# EAGLE design lpc810_console (EAGLE 7.1.0)
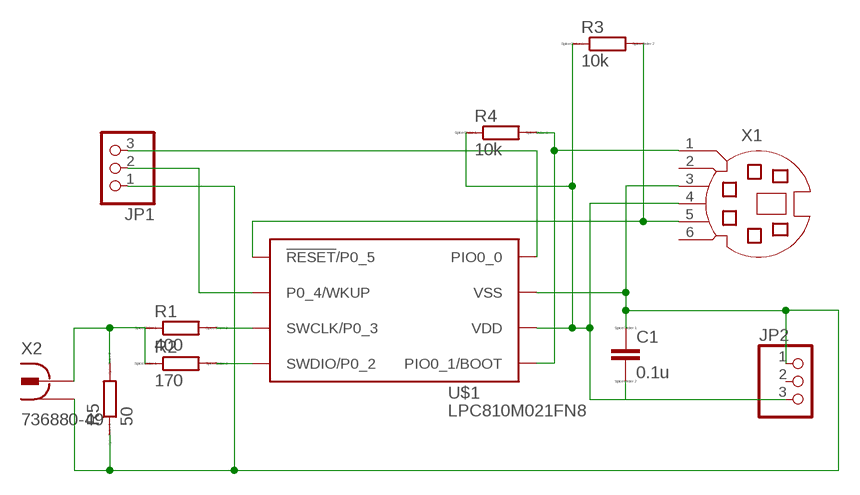
[diagram p0: schematic, sheet 1]

## Parts
C1  0.1u  CC0603  [C0603]
JP1  PINHD-1X3  [1X03]
JP2  PINHD-1X3  [1X03]
R1  400  RR0603  [R0603]
R2  170  RR0603  [R0603]
R3  10k  RR0603  [R0603]
R4  10k  RR0603  [R0603]
R5  50  RR0603  [R0603]
U$1  LPC810M021FN8  [DIP8]
X1  MD06S  [MDIN06S]
X2  736880-49  [736880-49]

## Nets
N$1: JP1.2 U$1.P$2(P0_4/WKUP)
N$2: C1.2 JP2.3 R3.1 R4.1 U$1.P$6(VDD) X1.4
N$3: R4.2 U$1.P$5(PIO0_1/BOOT) X1.1
N$4: R3.2 U$1.P$1(!RESET!/P0_5) X1.5
N$5: JP1.3 U$1.P$8(PIO0_0)
N$6: R1.2 U$1.P$3(SWCLK/P0_3)
N$7: R2.2 U$1.P$4(SWDIO/P0_2)
N$10: R1.1 R2.1 R5.2 X2.2
N$11: C1.1 JP1.1 JP2.1 R5.1 U$1.P$7(VSS) X1.3 X2.1 X2.1@1 X2.1@2
Unconnected: JP2.2 X1.2 X1.6

## Library data of the parts
C1 = eagle-ltspice:C: CAPACITOR, European symbol; SPICEMODEL: NONE; SPICEPREFIX: C
JP1 JP2 = pinhead:PINHD-1X3: PIN HEADER
R1-R5 = eagle-ltspice:R: RESISTOR, European symbol; SPICEMODEL: NONE; SPICEPREFIX: R
U$1 = carrilib:LPC810
X1 = con-yamaichi:MD06S: YAMAICHI CONNECTOR; OC_FARNELL: unknown; OC_NEWARK: unknown
X2 = con-conrad:736880-49: Cinch Connector ( RCA Jack ) Cinch-Einbaukupplung 90º 72345 Vernickelt BKL Electronic Source: Conrad <http://www.conrad.de/ce/de/product/736880>

## Board
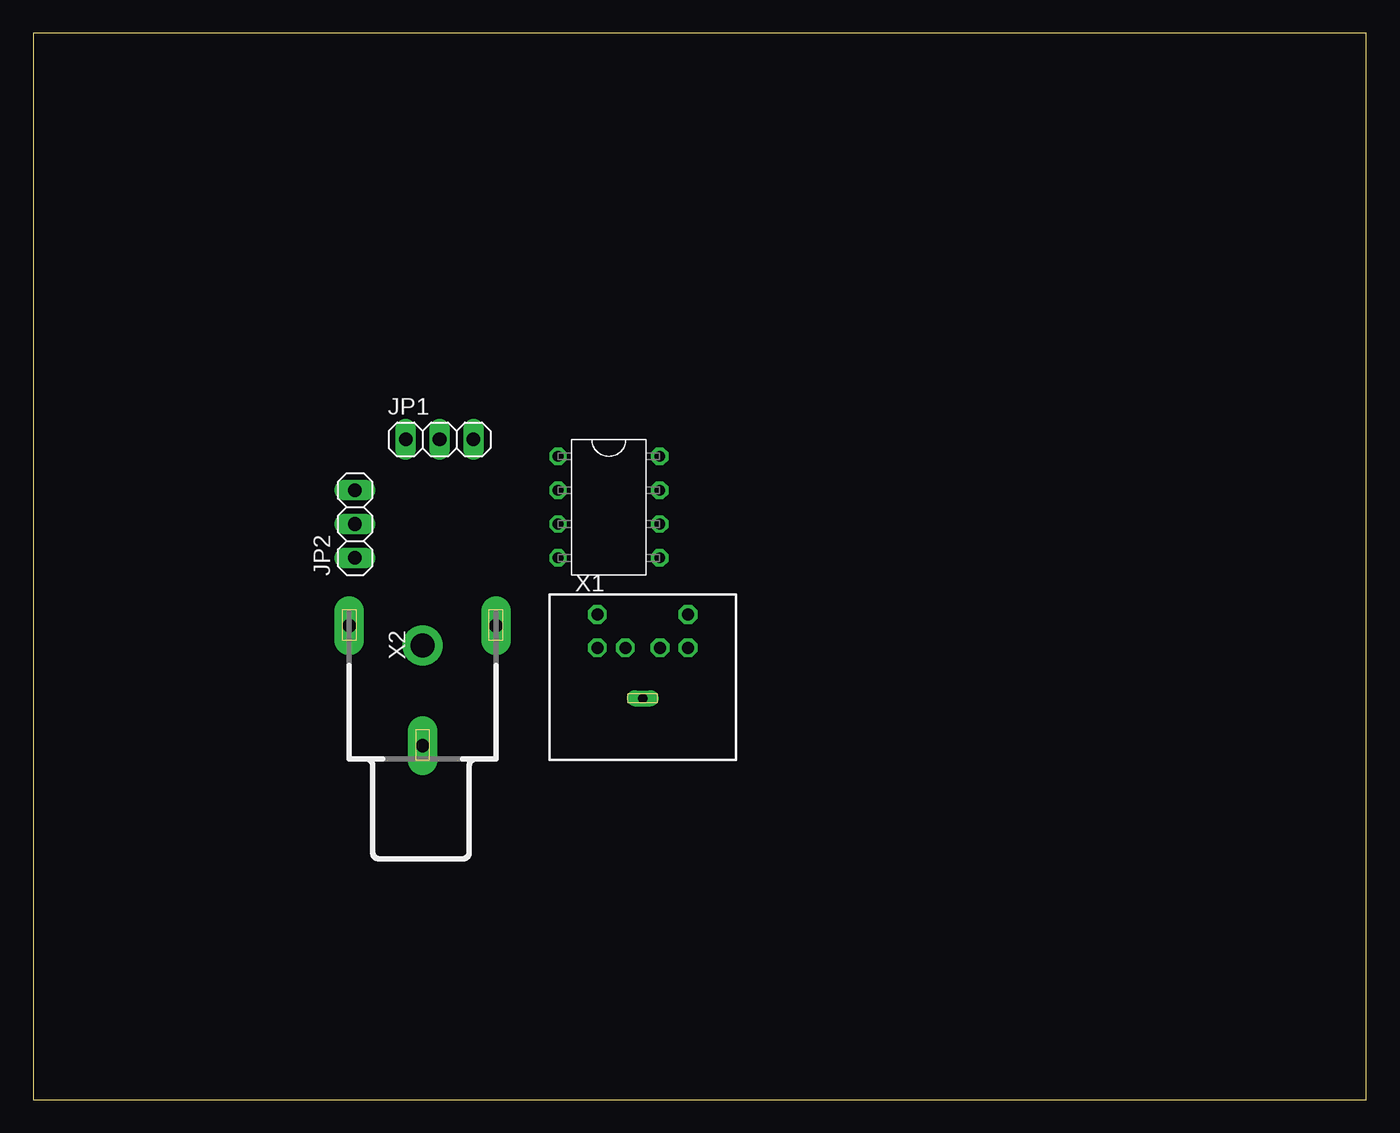
[diagram p1: board, top side]
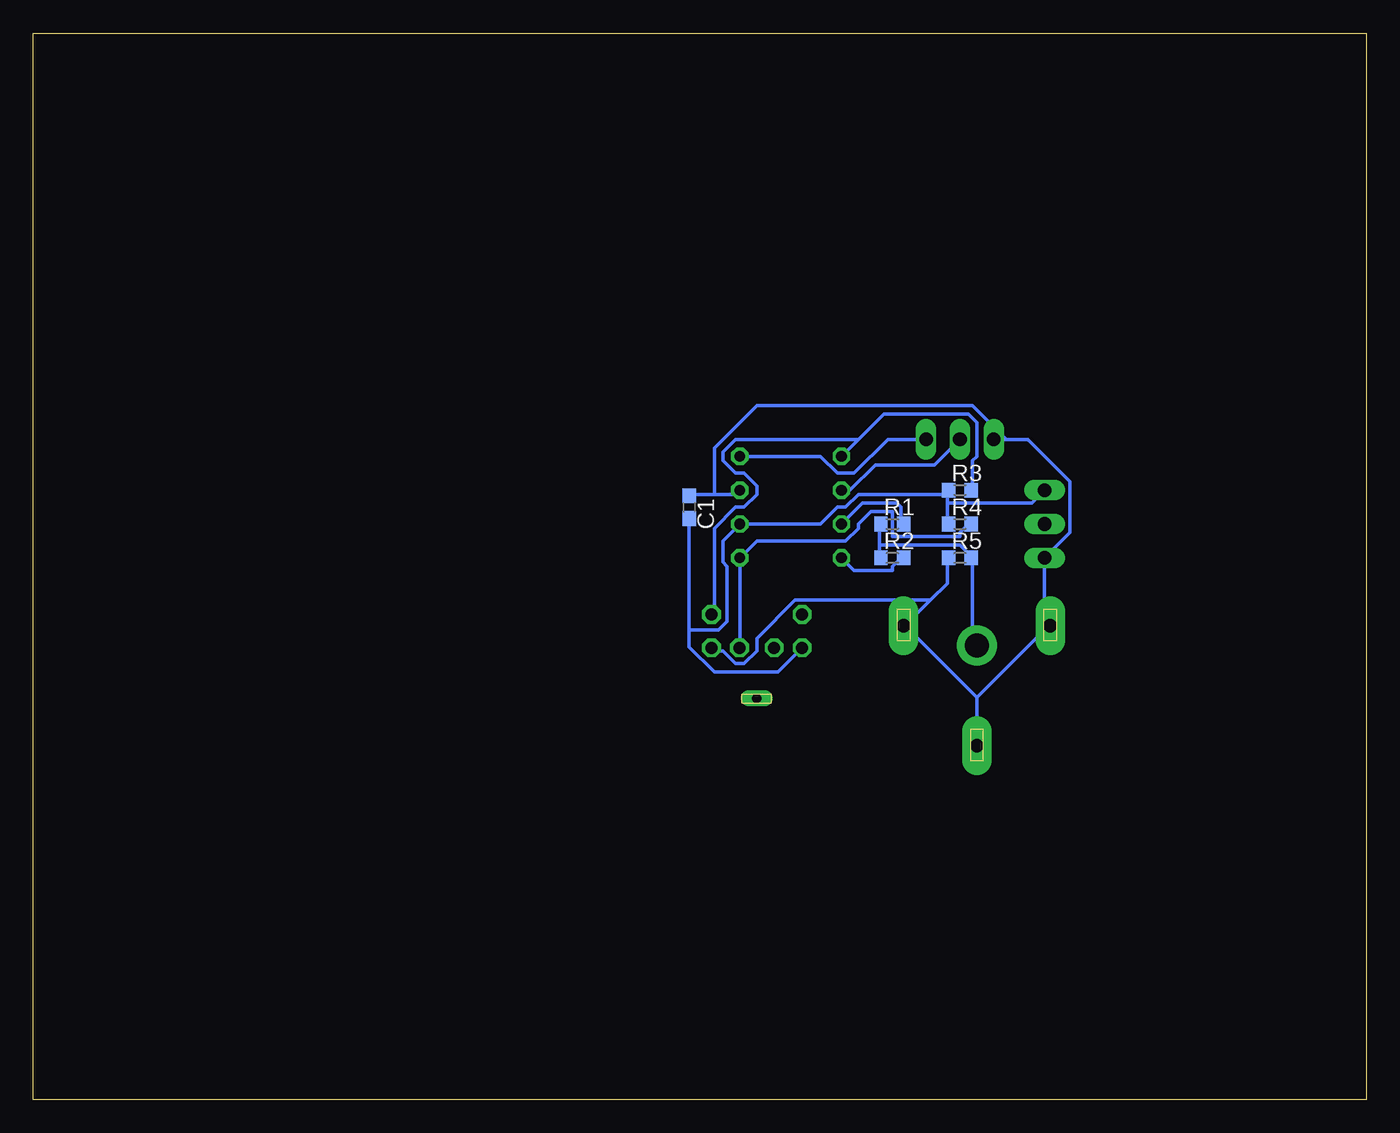
[diagram p2: board, bottom side, seen from below]

Size 100 x 80 mm. Coordinates in mm from the lower left corner, seen from the top.
Outline: 0,0 100,0 100,80 0,80 0,0
Copper layers (1*16): Top 0.035mm / dielectric 1.5mm / Bottom 0.035mm
Design rules "default": minimum track width 10mil, minimum drill 24mil, track to track 8mil, track to pad 8mil, pad to pad 8mil, via to via 8mil, smd to smd 8mil, copper to edge 40mil, drill to drill 8mil, minimum pad ring 10mil, minimum via ring 8mil, stop-mask expansion 4mil, vias tented up to drill 0mil, thermal gap 10mil

### Footprints (pad centres in the part's own frame; a part is rotated, then mirrored left to right if it is on the bottom)
C0603 = smd 1.1 x 1: 1 -0.85,0; 2 0.85,0
1X03 = drill 1.016 long: 1 -2.54,0; 2 0,0; 3 2.54,0
R0603 = smd 1 x 1.1: 1 -0.85,0; 2 0.85,0
DIP8 = drill 0.8 octagon: P$1 -3.81,3.81; P$2 -3.81,1.27; P$3 -3.81,-1.27; P$4 -3.81,-3.81; P$5 3.81,-3.81; P$6 3.81,-1.27; P$7 3.81,1.27; P$8 3.81,3.81
MDIN06S = drill 0.9 octagon: 1 1.3,8.5; 2 -1.3,8.5; 3 3.4,8.5; 4 -3.4,8.5; 5 3.4,11; 6 -3.4,11 | drill 0.7 long: M 0,4.7
736880-49 = drill 1 pad 2.2 long: 1 -3.92,0; 1@1 5.08,-5.5; 1@2 5.08,5.5 | drill 1.8 pad 3: 2 3.58,0

### Placement (x,y rotation side)
C1  50.8,44.45 270 bottom
JP1  30.48,49.53 0 top
JP2  24.13,43.18 90 top
R1  35.56,43.18 0 bottom
R2  35.56,40.64 0 bottom
R3  30.48,45.72 0 bottom
R4  30.48,43.18 0 bottom
R5  30.48,40.64 0 bottom
U$1  43.18,44.45 0 top
X1  45.72,25.4 0 top
X2  29.21,30.48 90 top

### Tracks (layer width: path | path; a pad name or v marks a point on that pad's centre or on a via)
N$1
  Bottom 0.254: U$1.P$2 38.73,45.72 36.83,47.62 32.38,47.62 JP1.2
N$2
  Bottom 0.254: 50.8,35.24 50.8,33.97 48.9,32.07 44.13,32.07 42.55,33.66 X1.4 | 50.8,35.24 C1.2 | 31.43,45.4 31.43,45.72 R3.1 31.43,45.4 | 31.43,45.4 31.43,44.77 | 31.43,44.77 31.43,43.18 R4.1 | 31.43,44.77 25.08,44.77 JP2.3 | 31.43,45.4 38.1,45.4 39.05,44.45 39.69,44.45 40.96,43.18 U$1.P$6 48.26,41.91 48.26,40.32 47.94,40.01 47.94,35.88 48.58,35.24 50.8,35.24
N$3
  Bottom 0.254: R4.2 29.84,43.18 30.48,42.55 30.48,42.23 35.56,42.23 35.56,44.13 37.15,44.13 38.1,43.18 38.1,42.86 39.05,41.91 45.72,41.91 U$1.P$5 46.99,33.97 X1.1
N$4
  Bottom 0.254: U$1.P$1 38.1,49.53 | 38.1,49.53 36.2,51.44 29.84,51.44 29.21,50.8 29.21,48.26 29.53,47.94 29.53,45.72 R3.2 | 38.1,49.53 47.31,49.53 48.26,48.58 48.26,47.94 47.31,46.99 46.67,46.99 45.72,46.04 45.72,45.4 46.67,44.45 47.31,44.45 48.9,42.86 48.9,36.51 X1.5
N$5
  Bottom 0.254: U$1.P$8 40.96,48.26 39.69,46.99 38.42,46.99 35.88,49.53 JP1.3
N$6
  Bottom 0.254: U$1.P$3 37.78,44.77 35.24,44.77 34.92,44.45 34.92,43.18 R1.2
N$7
  Bottom 0.254: U$1.P$4 38.42,39.69 35.56,39.69 35.56,40.01 34.92,40.64 R2.2
N$10
  Bottom 0.254: 36.51,41.59 36.51,43.18 R1.1 | 36.51,41.59 36.51,40.64 R2.1 | 29.53,40.64 29.53,34.61 29.21,34.29 X2.2 | 36.51,41.59 30.48,41.59 29.53,40.64 | 29.53,40.64 R5.2
N$11
  Bottom 0.254: 34.61,35.56 32.7,37.47 | 32.7,37.47 31.43,38.73 31.43,40.64 R5.1 | 32.7,37.47 42.86,37.47 45.72,34.61 45.72,33.66 46.67,32.7 47.31,32.7 48.26,33.66 48.9,33.66 X1.3 | 48.9,45.4 47.31,45.4 U$1.P$7 | 48.9,45.4 50.8,45.4 C1.1 | 23.81,35.56 24.13,35.88 JP2.1 22.23,42.55 22.23,46.35 25.4,49.53 26.99,49.53 | 26.99,49.53 JP1.1 | 48.9,45.4 48.9,48.9 45.72,52.07 29.53,52.07 26.99,49.53 | 29.21,30.16 X2.1 | 23.81,35.56 29.21,30.16 | 23.81,35.56 X2.1@2 | 29.21,30.16 34.61,35.56 | 34.61,35.56 X2.1@1